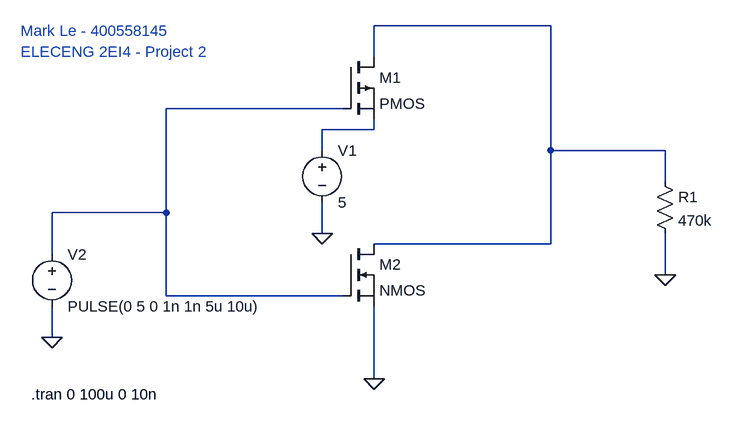
[diagram p0: schematic project2.asc]
project2.asc, the LTspice schematic file:
Version 4.1
SHEET 1 880 680
WIRE 384 32 112 32
WIRE 112 80 112 32
WIRE 64 160 -208 160
WIRE 112 192 112 176
WIRE 112 192 32 192
WIRE 32 224 32 192
WIRE 384 224 384 32
WIRE 560 224 384 224
WIRE 560 272 560 224
WIRE -208 320 -208 160
WIRE -208 320 -384 320
WIRE 32 352 32 304
WIRE 384 368 384 224
WIRE 384 368 112 368
WIRE -384 384 -384 320
WIRE 560 416 560 352
WIRE -208 448 -208 320
WIRE 64 448 -208 448
WIRE -384 512 -384 464
WIRE 112 576 112 464
FLAG 32 352 0
FLAG 112 576 0
FLAG -384 512 0
FLAG 560 416 0
SYMBOL pmos 64 80 R0
SYMATTR InstName M1
SYMBOL nmos 64 368 R0
SYMATTR InstName M2
SYMBOL voltage 32 208 R0
WINDOW 123 0 0 Left 0
WINDOW 39 0 0 Left 0
SYMATTR InstName V1
SYMATTR Value 5
SYMBOL voltage -384 368 R0
WINDOW 123 0 0 Left 0
WINDOW 39 0 0 Left 0
SYMATTR InstName V2
SYMATTR Value PULSE(0 5 0 1n 1n 5u 10u)
SYMBOL res 544 256 R0
SYMATTR InstName R1
SYMATTR Value 470k
SYMATTR SpiceLine tol=5 pwr=0.5
TEXT -416 600 Left 2 !.tran 0 100u 0 10n
TEXT -432 40 Left 2 ;Mark Le - 400558145
TEXT -432 72 Left 2 ;ELECENG 2EI4 - Project 2

The netlist it stands for:
* project2.asc
M1 N001 N002 N003 N003 PMOS
M2 N001 N002 0 0 NMOS
V1 N003 0 5
V2 N002 0 PULSE(0 5 0 1n 1n 5u 10u)
R1 N001 0 470k tol=5 pwr=0.5
.model NMOS NMOS
.model PMOS PMOS
.lib standard.mos
.tran 0 100u 0 10n
* Mark Le - 400558145
* ELECENG 2EI4 - Project 2
.backanno
.end